# Altium schematic sheet PowerStage.SchDoc
size A; SheetNumber: 2; SheetTotal: 5
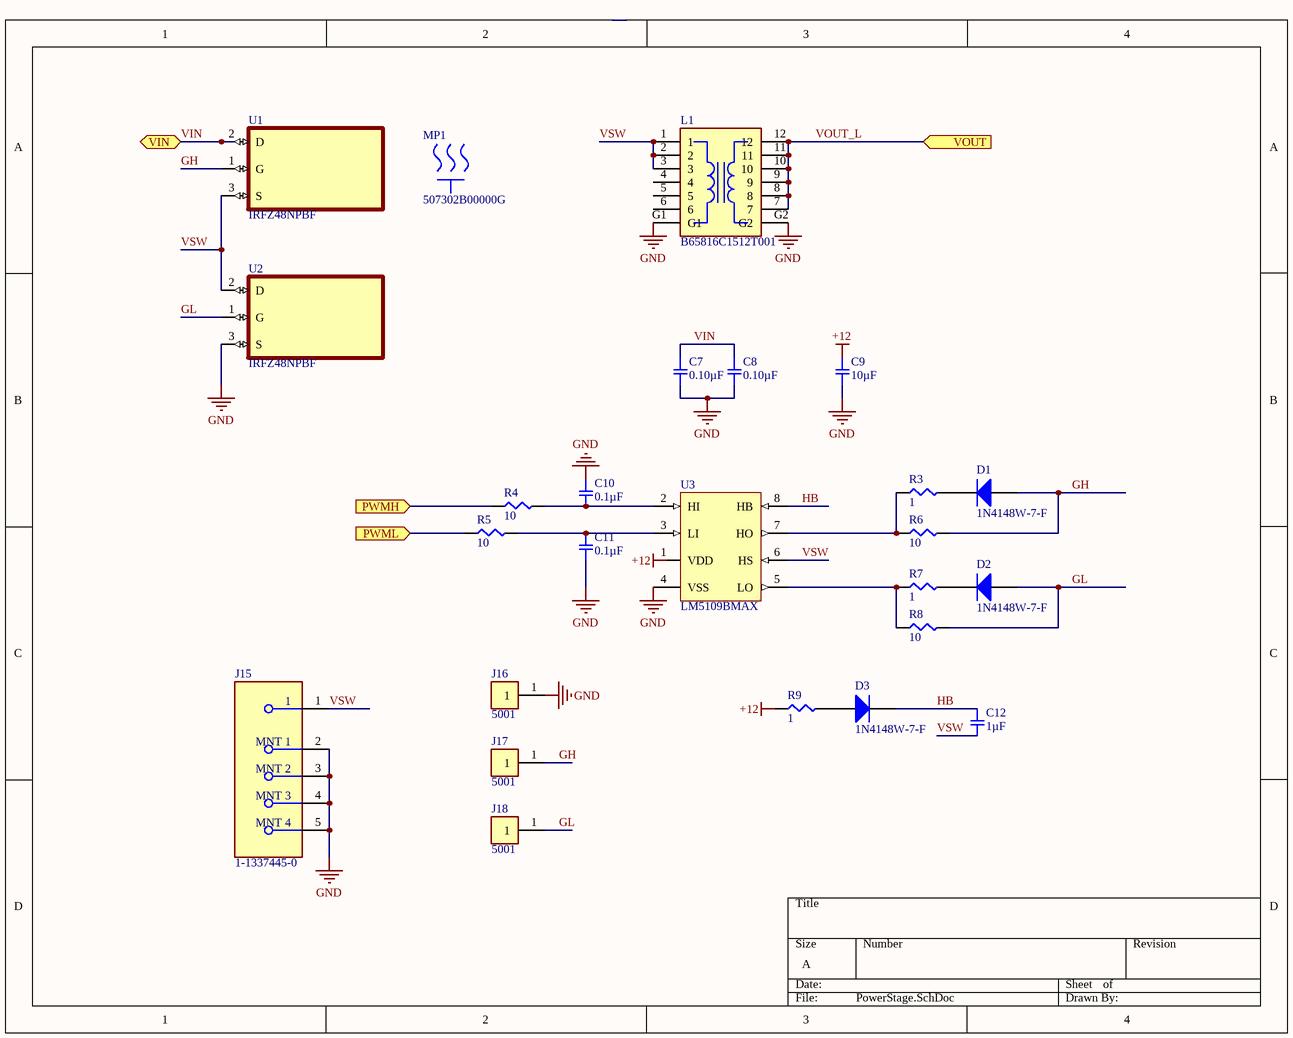
[diagram p0: PowerStage.SchDoc]

## Parts
C7  0.10µF  [SMD-0603-RES]
C8  0.10µF  [SMD-0603-RES]
C9  10µF  [SMD-0603-RES]
C10  0.1µF  [SMD-0603-RES]
C11  0.1µF  [SMD-0603-RES]
C12  1µF  [SMD-0603-RES]
D1  1N4148W-7-F  [DIOD-SOD123-2_V]
D2  1N4148W-7-F  [DIOD-SOD123-2_V]
D3  1N4148W-7-F  [DIOD-SOD123-2_V]
J15  1-1337445-0  [FP-1-1337445-0-MFG]
J16  5001  [FP-5001-MFG]
J17  5001  [FP-5001-MFG]
J18  5001  [FP-5001-MFG]
L1  B65816C1512T001  [B65816C1512T001]
MP1  507302B00000G  [FP-507302B00000G-MFG]
R3  1  [SMD-0603-RES]
R4  10  [SMD-0603-RES]
R5  10  [SMD-0603-RES]
R6  10  [SMD-0603-RES]
R7  1  [SMD-0603-RES]
R8  10  [SMD-0603-RES]
R9  1  [SMD-0603-RES]
U1  IRFZ48NPBF  [TO254P1041X444X1930-3]
U2  IRFZ48NPBF  [TO254P1041X444X1930-3]
U3  LM5109BMAX  [M08A_L]

## Ports
PWMH (in), PWML (in), VIN (bidir), VOUT (in)

## Nets
+12: C9.1 R9.1
GND: C7.2 C8.2 C9.2 C10.1 C11.2 J15.2(MNT_1) J15.3(MNT_2) J15.4(MNT_3) J15.5(MNT_4) J16.1 L1.G1 L1.G2 U2.3(S) U3.4(VSS)
GH: D1.1(A) J17.1 R6.2 U1.1(G)
GL: D2.1(A) J18.1 R8.2 U2.1(G)
HB: C12.1 D3.2(K) U3.8(HB)
PWMH: R4.1 ; port PWMH
PWML: R5.1 ; port PWML
VIN: C7.1 C8.1 U1.2(D) ; port VIN
VOUT_L: L1.7 L1.8 L1.9 L1.10 L1.11 L1.12 ; port VOUT
VSW: C12.2 J15.1 L1.1 L1.2 L1.3 U1.3(S) U2.2(D) U3.6(HS)
NetC10_2: C10.2 R4.2 U3.2(HI)
NetC11_1: C11.1 R5.2 U3.3(LI)
NetD1_2: D1.2(K) R3.2
NetD2_2: D2.2(K) R7.2
NetD3_1: D3.1(A) R9.2
NetR3_1: R3.1 R6.1 U3.7(HO)
NetR7_1: R7.1 R8.1 U3.5(LO)

Not connected (* = marked no-connect by the designer): L1 4 5 6; U3 1(VDD)

## Notes on the sheet
- Labels drawn without touching a wire or pin: +12

## Library data of the parts
C7 C8 = GRM188R71C104KA01D: CAP CER 0.1UF 16V X7R 0603; Manufacturer: Murata Electronics North America; Factory Stock: 0; Unit Price (USD): 0.1; Minimum Quantity: 1; Tolerance: ±10%; Part Number: GRM188R71C104KA01D; Datasheets: http://www.murata.com/~/media/webrenewal/support/library/catalog/products/capacitor/mlcc/c02e.pdf; Image: //media.digikey.com/Renders/Murata%20Renders/ZRB-SERIES-0402.jpg; Digi-Key Part Number: 490-1532-1-ND; Quantity Available: 4520200; @ qty: 0; Packaging: Cut Tape (CT); Series: GRM; Part Status: Active; Value: 0.10µF; Voltage: 16V; Temperature Coefficient: X7R; Operating Temperature: -55°C ~ 125°C; Features: -; Ratings: -; Applications: General Purpose; Mounting Type: Surface Mount, MLCC; Package / Case: 0603 (1608 Metric); Size / Dimension: 0.063" L x 0.031" W (1.60mm x 0.80mm); Height - Seated (Max): -; Thickness (Max): 0.035" (0.90mm); Lead Spacing: -; Lead Style: -
C9 = GRM188R61A106KE69D: CAP CER 10UF 10V X5R 0603; Manufacturer: Murata Electronics North America; Factory Stock: 0; Unit Price (USD): 0.18; Minimum Quantity: 1; Tolerance: ±10%; Part Number: GRM188R61A106KE69D; Datasheets: http://www.murata.com/~/media/webrenewal/support/library/catalog/products/capacitor/mlcc/c02e.pdf; Image: //media.digikey.com/Renders/Murata%20Renders/ZRB-SERIES-0402.jpg; Digi-Key Part Number: 490-10474-1-ND; Quantity Available: 59221; @ qty: 0; Packaging: Cut Tape (CT); Series: GRM; Part Status: Active; Value: 10µF; Voltage: 10V; Temperature Coefficient: X5R; Operating Temperature: -55°C ~ 85°C; Features: Derating Recommended; Ratings: -; Applications: General Purpose; Mounting Type: Surface Mount, MLCC; Package / Case: 0603 (1608 Metric); Size / Dimension: 0.063" L x 0.031" W (1.60mm x 0.80mm); Height - Seated (Max): -; Thickness (Max): 0.037" (0.95mm); Lead Spacing: -; Lead Style: -; ComponentLink1Description: New link; ComponentLink1URL: *
C10 C11 = GRM188R61C225KE15D: CAP CER 2.2UF 16V X5R 0603; Manufacturer: Murata Electronics North America; Factory Stock: 0; Unit Price (USD): 0.12; Minimum Quantity: 1; Tolerance: ±10%; Part Number: GRM188R61C225KE15D; Datasheets: http://www.murata.com/~/media/webrenewal/support/library/catalog/products/capacitor/mlcc/c02e.pdf; Image: //media.digikey.com/Renders/Murata%20Renders/ZRB-SERIES-0402.jpg; Digi-Key Part Number: 490-3296-1-ND; Quantity Available: 1668676; @ qty: 0; Packaging: Cut Tape (CT); Series: GRM; Part Status: Active; Value: 0.1µF; Voltage: 16V; Temperature Coefficient: X5R; Operating Temperature: -55°C ~ 85°C; Features: -; Ratings: -; Applications: General Purpose; Mounting Type: Surface Mount, MLCC; Package / Case: 0603 (1608 Metric); Size / Dimension: 0.063" L x 0.031" W (1.60mm x 0.80mm); Height - Seated (Max): -; Thickness (Max): 0.035" (0.90mm); Lead Spacing: -; Lead Style: -
C12 = GRM188R61E105KA12D: CAP CER 1UF 25V X5R 0603; Manufacturer: Murata Electronics North America; Factory Stock: 0; Unit Price (USD): 0.1; Minimum Quantity: 1; Tolerance: ±10%; Part Number: GRM188R61E105KA12D; Datasheets: http://www.murata.com/~/media/webrenewal/support/library/catalog/products/capacitor/mlcc/c02e.pdf; Image: //media.digikey.com/Renders/Murata%20Renders/ZRB-SERIES-0402.jpg; Digi-Key Part Number: 490-3897-1-ND; Quantity Available: 1883393; @ qty: 0; Packaging: Cut Tape (CT); Series: GRM; Part Status: Active; Value: 1µF; Voltage: 25V; Temperature Coefficient: X5R; Operating Temperature: -55°C ~ 85°C; Features: -; Ratings: -; Applications: General Purpose; Mounting Type: Surface Mount, MLCC; Package / Case: 0603 (1608 Metric); Size / Dimension: 0.063" L x 0.031" W (1.60mm x 0.80mm); Height - Seated (Max): -; Thickness (Max): 0.035" (0.90mm); Lead Spacing: -; Lead Style: -
D1-D3 = CMP-2000-04932-2: Fast Switching Diode, 100 V, 0.15 A, -65 to 150 degC, 2-Pin?SOD123, RoHS, Tape and Reel; Manufacturer: Diodes; Recovery Time: 4ns; Brand: DiodesIncorporated; Unit Weight: 0.000353oz; Max Surge Current: 2A; Peak Reverse Voltage: 100V; Ir - Reverse Current: 1uA; Vf - Forward Voltage: 1.25V; Configuration: Single; If - Forward Current: 0.15A; Product Category: Diodes-GeneralPurpose,Power,Switching; Operating Temperature Range: -65Cto+150C; Packaging: Reel; Manufacturer URL: http://www.diodes.com/; Maximum Operating Temperature: +150C; Height: 1.25mm; Minimum Operating Temperature: -65C; Product: SwitchingDiodes; Package URL: http://www.diodes.com/datasheets/ds18004.pdf; Type: SwitchingDiode; Package Reference: SOD123-2; Width: 1.7mm; Datasheet URL: http://www.farnell.com/datasheets/1915529.pdf; Datasheet Version: Rev. 24-2, 10/2013; Series: 1N4148; Factory Pack Quantity: 3000; Length: 2.85mm; RoHS: True; Manufacturer: DiodesIncorporated; Mounting Style: SMD/SMT; Package / Case: SOD-123; Manufacturer Part Number: 1N4148W-7-F
J15 = CMP-03357-000006-1: CONN BNC JACK STR 50 OHM PCB; Manufacturer: TE Connectivity; PCB Mount Retention: With; Operating Frequency: 0 to 4Hz; PCB Mounting Orientation: Vertical; PCB Thickness: 0.126inch; Body Plating: Silver; Frequency: 4GHz; Impedance: 50R; Insulation Resistance: 5GR; Body Material: Brass; Dielectric Material: PTFE; Gender: Female; Sealable: No (Without); Number of Positions: 1; Orientation: Straight; RoHS Compliant: Yes; Min Operating Temperature: -65°C; Packaging: Bag; Fastening Type: Bayonet; Radiation Hardening: No; Max Frequency: 4GHz; Material: Brass; Contact Plating: Silver; ELV: Compliant; Depth: 12mm; Series: BNC; Package Quantity: 50; Connector Type: BNC; Contact Material: Brass; Max Operating Temperature: 165°C; Length: 12mm; Termination: Solder; Mount: Through Hole; Insulation Material: Polytetrafluoroethylene; Manufacturer Part Number: 1-1337445-0
J16-J18 = CMP-2000-05181-2: PC TEST POINT MINIATURE BLACK; Manufacturer: Keystone Electronics; Body Material: Bronze; Plating: Silver; Inside Diameter: 1.27mm; Hole Diameter: 1.6mm; Number of Ports: 1; Outside Diameter: 2.54mm; Insulation: Insulated; Insulation Material: Nylon; Mount: Through Hole; RoHS Compliant: Yes; Series: THM; Height: 0.3inch; Termination: Through Hole; Material: Nylon; Packaging: Bulk; Contact Material: Bronze; REACH SVHC: No SVHC; Contact Plating: Silver; Orientation: Straight; Lead Free: Lead Free; Package Quantity: 100; Length: 7.62mm; Flammability Rating: UL94 V-0; Number of Contacts: 1; Diameter: 2.54mm; Housing Color: Black; Color: Black; Manufacturer Part Number: 5001
L1 = B65816C1512T001: BOBBIN COIL FORMER RM 12
MP1 = CMP-69313-000007-1: HEATSINK TO-220 2.5W LOW PROFILE; Manufacturer: Aavid Thermalloy; Thermal Resistance @ Forced Air Flow (100 LFM): 10°C/W; Natural Thermal Resistance: 24°C/W; Finish: Anodized; Shape: Square; Height Off Base: 0.38inch; Series: 5073; Package Cooled: TO-220; RoHS Compliant: Yes; Type: Passive; Color: Black; Length: 19.05mm; Package Quantity: 2000; Case/Package: TO-220; Mount: Bolt; Packaging: Bulk; Width: 19.05mm; Depth: 19.05mm; Material: Aluminium; Height: 9.65mm; Weight: 0.25lb; Lead Free: Lead Free; Radiation Hardening: No; REACH SVHC: No SVHC; Manufacturer Part Number: 507302B00000G
R3 R7 = ERJ-3EKF10R0V: RES SMD 10 OHM 1% 1/10W 0603; Manufacturer: Panasonic Electronic Components; Factory Stock: 0; Unit Price (USD): 0.00379; @ qty: 1500; Power (Watts): 0.1W, 1/10W; Temperature Coefficient: ±100ppm/°C; Part Number: ERJ-3EKF10R0V; Datasheets: http://industrial.panasonic.com/www-cgi/jvcr13pz.cgi?E+PZ+3+AOA0002+ERJ3EKF10R0V+7+WW; Image: //media.digikey.com/Photos/Panasonic%20Photos/MFG_ERJ-P6W%20Series.jpg; Digi-Key Part Number: P10.0HCT-ND; Quantity Available: 676435; Minimum Quantity: 1; Packaging: Cut Tape (CT); Series: ERJ; Part Status: Active; Value: 1; Tolerance: ±1%; Composition: Thick Film; Features: Automotive AEC-Q200; Operating Temperature: -55°C ~ 155°C; Package / Case: 0603 (1608 Metric); Supplier Device Package: 0603; Size / Dimension: 0.063" L x 0.031" W (1.60mm x 0.80mm); Height - Seated (Max): 0.022" (0.55mm); Number of Terminations: 2; Failure Rate: -
R4-R6 R8 = ERJ-3EKF10R0V: RES SMD 10 OHM 1% 1/10W 0603; Manufacturer: Panasonic Electronic Components; Factory Stock: 0; Unit Price (USD): 0.00379; @ qty: 1500; Minimum Quantity: 1; Power (Watts): 0.1W, 1/10W; Temperature Coefficient: ±100ppm/°C; Part Number: ERJ-3EKF10R0V; Datasheets: http://industrial.panasonic.com/www-cgi/jvcr13pz.cgi?E+PZ+3+AOA0002+ERJ3EKF10R0V+7+WW; Image: //media.digikey.com/Photos/Panasonic%20Photos/MFG_ERJ-P6W%20Series.jpg; Digi-Key Part Number: P10.0HCT-ND; Quantity Available: 676435; Packaging: Cut Tape (CT); Series: ERJ; Part Status: Active; Value: 10; Tolerance: ±1%; Composition: Thick Film; Features: Automotive AEC-Q200; Operating Temperature: -55°C ~ 155°C; Package / Case: 0603 (1608 Metric); Supplier Device Package: 0603; Size / Dimension: 0.063" L x 0.031" W (1.60mm x 0.80mm); Height - Seated (Max): 0.022" (0.55mm); Number of Terminations: 2; Failure Rate: -
R9 = ERJ-3BQF1R0V: RES SMD 1 OHM 1% 1/4W 0603; Manufacturer: Panasonic Electronic Components; Factory Stock: 0; Unit Price (USD): 0.05386; @ qty: 1500; Power (Watts): 0.25W, 1/4W; Temperature Coefficient: ±200ppm/°C; Part Number: ERJ-3BQF1R0V; Datasheets: https://industrial.panasonic.com/cdbs/www-data/pdf/RDA0000/AOA0000C239.pdf; Image: //media.digikey.com/Photos/Panasonic%20Photos/MFG_ERJ-P6W%20Series.jpg; Digi-Key Part Number: P17371CT-ND; Quantity Available: 30514; Minimum Quantity: 1; Packaging: Cut Tape (CT); Series: ERJ; Part Status: Active; Value: 1; Tolerance: ±1%; Composition: Thick Film; Features: Automotive AEC-Q200, Current Sense; Operating Temperature: -55°C ~ 125°C; Package / Case: 0603 (1608 Metric); Supplier Device Package: 0603; Size / Dimension: 0.063" L x 0.031" W (1.60mm x 0.80mm); Height - Seated (Max): 0.022" (0.55mm); Number of Terminations: 2; Failure Rate: -
U1 U2 = IRFZ48NPBF: MF: {'manufacturer': u'Infineon Technologies'}; Package: None; Price: None; Value: *; MP: IRFZ48NPBF; Availability: Unavailable
U3 = CMP-0063-00512-2: High Voltage 1A Peak Half Bridge Gate Driver, 8-pin Narrow SOIC; Manufacturer: National Semiconductor; Manufacturer: TI National Semiconductor; PowerWise: N; PackageTopMarking: NSZXTT*L5109*BMA; CompType: MiscPower; ComponentLink2URL: http://www.national.com/pf/LM/LM5109B.html; PackageReference: M08A; Code_IPC: SOIC127P600-8; ComponentLink1Description: LM5109B Datasheet; ComponentLink1URL: http://www.national.com/ds/LM/LM5109B.pdf; ComponentLink3Description: M08A Package Page; RoHS: N; ComponentLink3URL: http://www.national.com/packaging/folders/m08a.html; ComponentLink2Description: LM5109B Web Page; DatasheetVersion: Feb-2007; PinCount: 8; RevisionNote: Component URLs added; Code_JEDEC: MS-012-AA; PackageVersion: revM, May-2009; PackageDescription: SOIC Narrow, 4.9 x 3.9 x 1.45mm, 8 Lead, 1.27mm Pitch; Manufacturer Part Number: LM5109BMAX